# Altium project PCB_Project.PrjPcb
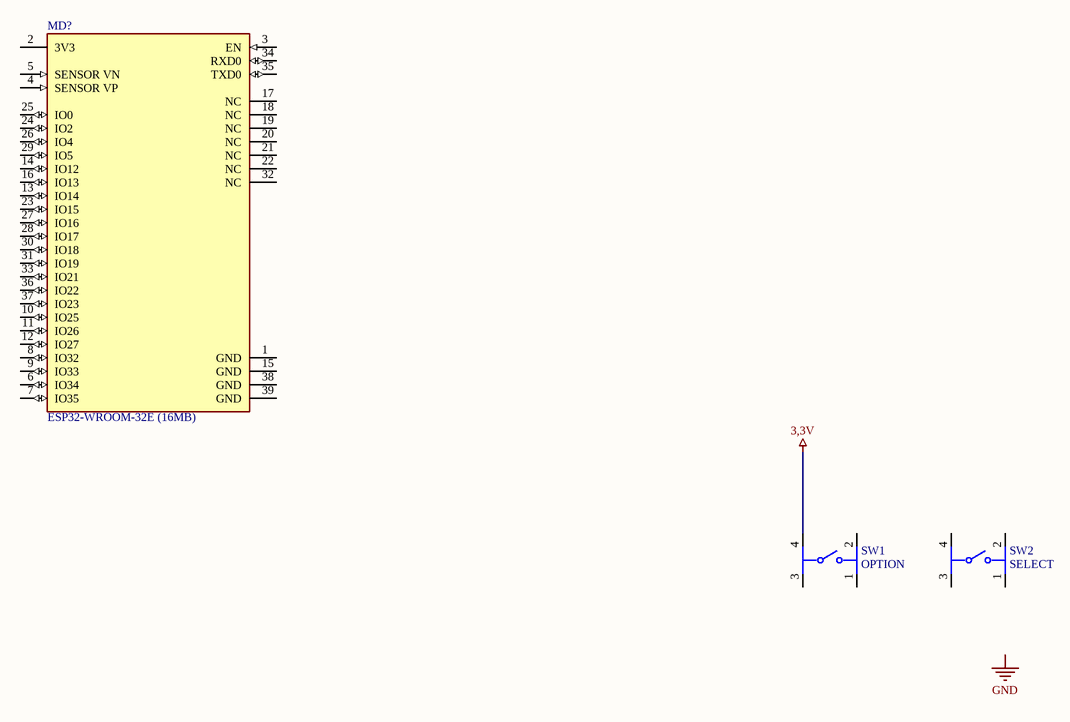
[diagram p0: Sheet1.SchDoc]
1 sheet, 3 parts. Net scope: global (net labels, ports and power ports of the same name join across sheets).

## Sheet Sheet1.SchDoc
size A4; SheetNumber: 1; SheetTotal: 1

### Parts
MD?  ESP32-WROOM-32E (16MB)  [FP-ESP32-WROOM-32E_16MB-MFG]
SW1  OPTION  [FP-FSM103-MFG]
SW2  SELECT  [FP-FSM103-MFG]

### Nets
3,3V: SW1.4

Not connected (* = marked no-connect by the designer): MD? 1(GND) 2(3V3) 3(EN) 4(SENSOR_VP) 5(SENSOR_VN) 6(IO34) 7(IO35) 8(IO32) 9(IO33) 10(IO25) 11(IO26) 12(IO27) 13(IO14) 14(IO12) 15(GND) 16(IO13) 17(NC) 18(NC) 19(NC) 20(NC) 21(NC) 22(NC) 23(IO15) 24(IO2) 25(IO0) 26(IO4) 27(IO16) 28(IO17) 29(IO5) 30(IO18) 31(IO19) 32(NC) 33(IO21) 34(RXD0) 35(TXD0) 36(IO22) 37(IO23) 38(GND) 39(GND); SW1 1 2 3; SW2 1 2 3 4

### Notes on the sheet
- Labels drawn without touching a wire or pin: GND

### Library data of the parts
MD? = CMP-194065-000027-1: RX TXRX MOD WIFI TRACE ANT SMD
SW1 SW2 = CMP-03407-000037-1: SWITCH TACTILE SPST-NO 0.05A 24V; Contact Resistance: 100mR; Actuator Length: 3.4mm; Switch Function: Off-Mom; Operating Force: 1.57N; Illumination Type: Non-Illuminated; Voltage Rating (DC): 12V; Current Rating: 50mA; Actuator Material: Polyester; Switch Travel: 0.3mm; Throw Configuration: SPST; Actuator Color: Black; Mechanical Life: 100000Cycles; Depth: 14.1mm; RoHS Compliant: Yes; Max Operating Temperature: 85°C; Mount: Through Hole; Min Operating Temperature: -35°C; Contact Plating: Silver; Width: 12mm; Package Quantity: 400; Radiation Hardening: No; Series: FSM100 ~ 104; Type: Switch; Termination: PC Pins; Voltage Rating: 24V; Contact Material: Brass; Max Voltage Rating (DC): 12V; Contact Current Rating: 50mA; Length: 12mm; Packaging: Loose Piece; Orientation: Straight; Max Current Rating: 50mA; Electrical Life: 100000Cycles